# EAGLE design R3Mkr12F_MB_ (EAGLE 9.0.1)
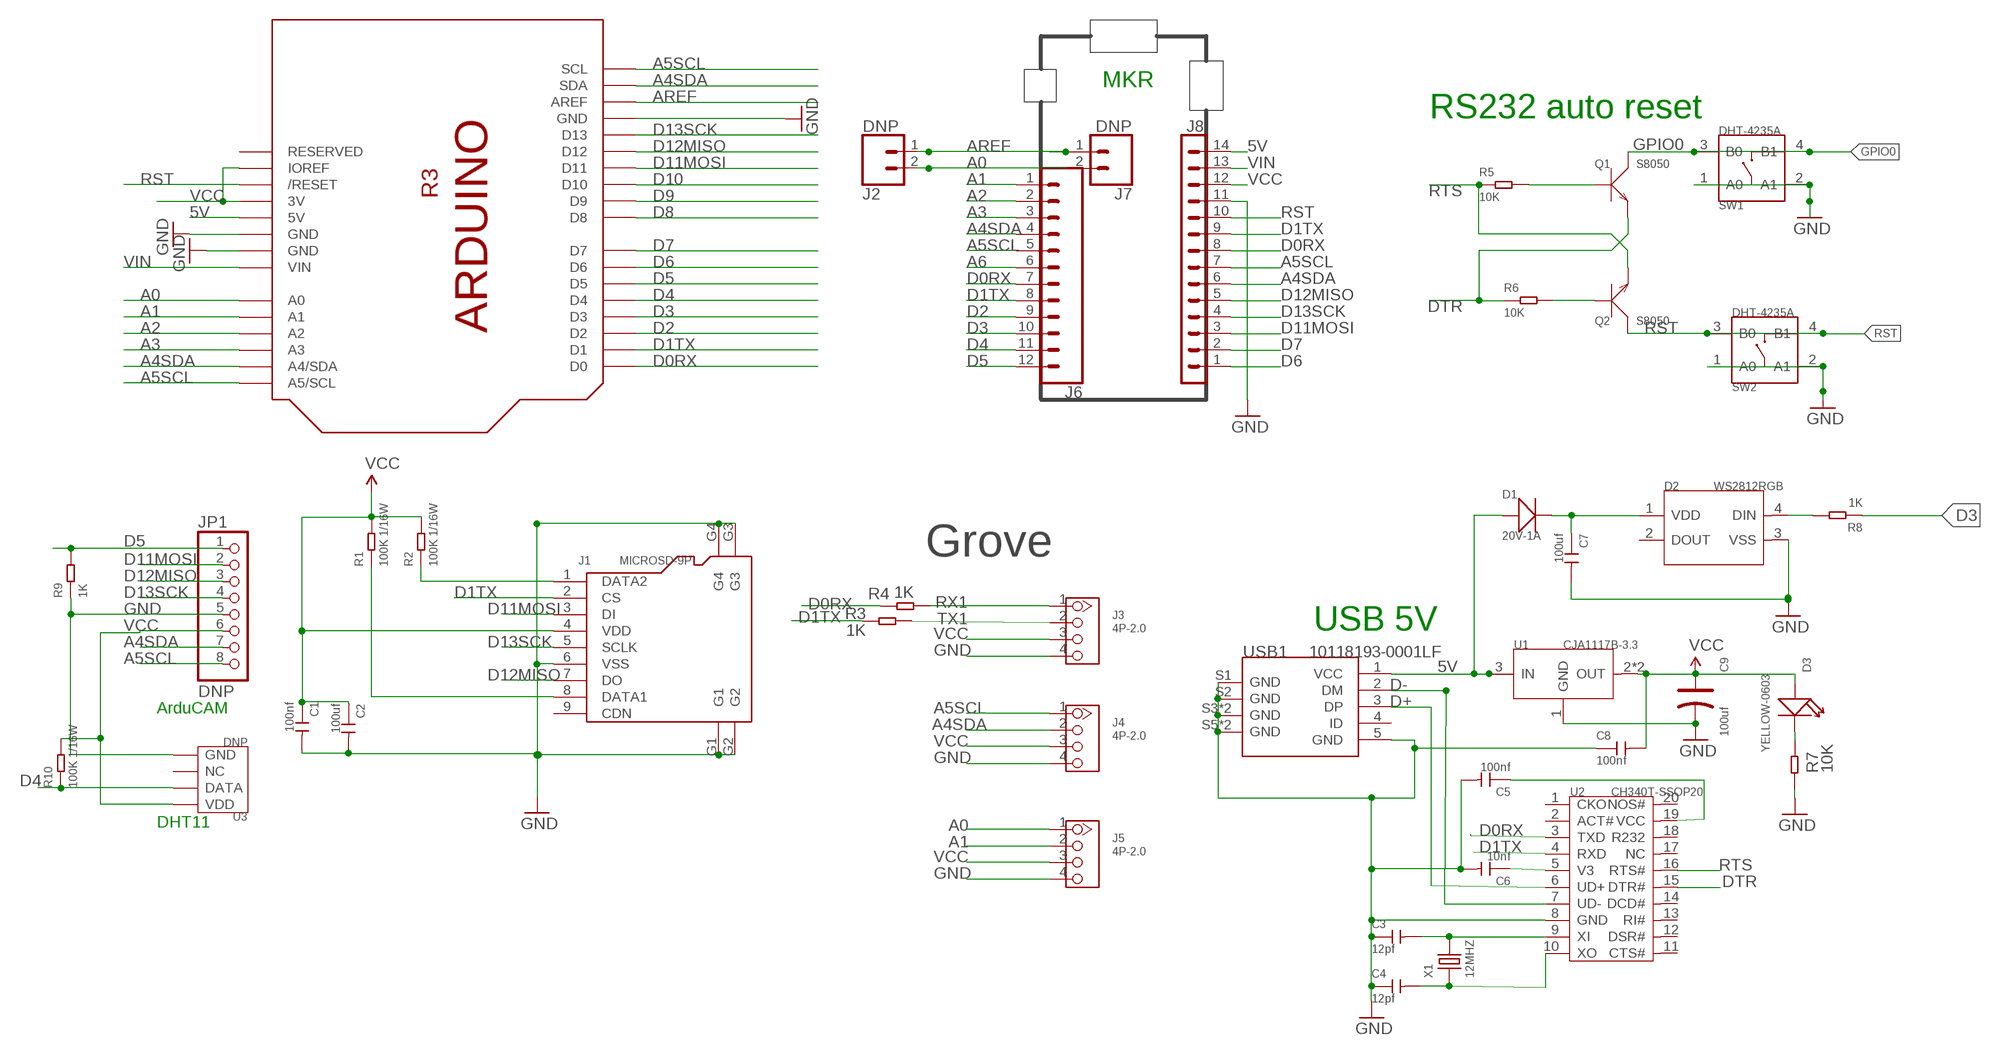
[diagram p0: schematic, sheet 1]

## Parts
C1  100nf  CERAMIC-100NF-50V-10%-X7R(0603)  [C0603]
C2  100uf  CERAMIC-100UF-6.3V-20%-X5R(1206)  [C1206]
C3  12pf  CERAMIC-12PF-50V-5%-NPO(0402)  [C0402]
C4  12pf  CERAMIC-12PF-50V-5%-NPO(0402)  [C0402]
C5  100nf  CERAMIC-100NF-50V-10%-X7R(0603)  [C0603]
C6  10nf  CERAMIC-10NF-50V-10%-X7R(0603)  [C0603]
C7  100uf  CERAMIC-100UF-6.3V-20%-X5R(1206)  [C1206]
C8  100nf  CERAMIC-100NF-50V-10%-X7R(0603)  [C0603]
C9  100uf  TANTALUM-SMD-100UF-10V(AVX-B)  [AVX-B]
D1  20V-1A  SMD-DIODE-SCHOTTKY-20V-1A(SOD-123)  [SOD-123]
D2  WS2812RGB  SMD-RGB-LED-4P'WS2812B'  [LED4-SMD-5050]
D3  YELLOW-0603  SMD-LED-CLEAR-YELLOW(0603)  [LED-0603]
J1  MICROSD-9P  MICRO-SD-CARD-HOLDER-9P  [MICRO-SD9+4P-SMD-16.1X14.5X1.85MM]
J2  DNP  CONN_02  [1X02]
J3  4P-2.0  GROVE-CONNECTOR-DIP(4P-2.0)  [HW4-2.0]
J4  4P-2.0  GROVE-CONNECTOR-DIP(4P-2.0)  [HW4-2.0]
J5  4P-2.0  GROVE-CONNECTOR-DIP(4P-2.0)  [HW4-2.0]
J6  CONN_12LOCK  [1X12_LOCK]
J7  DNP  CONN_02  [1X02]
J8  DNP  STRIP-14STD  [1X14]
JP1  DNP  MILLER_PINHD-1X8LOCK  [MILLER_1X08-LOCK]
Q1  S8050  SMD-TRANSISTORS-NPN-25V-500MW-S8050(SOT-23)  [SOT-23]
Q2  S8050  SMD-TRANSISTORS-NPN-25V-500MW-S8050(SOT-23)  [SOT-23]
R1  100K 1/16W  SMD-RES-100K-5%-1/16W(0402)  [R0402]
R2  100K 1/16W  SMD-RES-100K-5%-1/16W(0402)  [R0402]
R3  1K  SMD-RES-1K-5%-1/8W(0805)  [R0805]
R4  1K  SMD-RES-1K-5%-1/8W(0805)  [R0805]
R5  10K  SMD-RES-10K-5%-1/(0402)  [R0402]
R6  10K  SMD-RES-10K-5%-1/(0402)  [R0402]
R7  10K  SMD-RES-10K-5%-1/(0402)  [R0402]
R8  1K  SMD-RES-1K-5%-1/8W(0805)  [R0805]
R9  1K  SMD-RES-1K-5%-1/8W(0805)  [R0805]
R10  100K 1/16W  SMD-RES-100K-5%-1/16W(0402)  [R0402]
SW1  DHT-4235A  SMD-BUTTON-TOP-DHT-4235A(4P-4.2X3.2MM)  [SW4-SMD-4.2X3.2X2.5MM]
SW2  DHT-4235A  SMD-BUTTON-TOP-DHT-4235A(4P-4.2X3.2MM)  [SW4-SMD-4.2X3.2X2.5MM]
U1  CJA1117B-3.3  PMIC-CJ1117'SOT89'  [SOT-89]
U2  CH340T-SSOP20  INTERFACE-CH340T(SSOP20)  [SSOP20-0.65-7.6X5.2MM]
U3  DNP  TEM-HUM-DHT11(4P-15.5X12.0MM)  [SNR4-2.54-15.5X12.0X5.5MM]
UNO1  ARDUINO_R3_NOICSP_47MM  [ARDUINOR3_NOICSP_47MM]
USB1  10118193-0001LF  MICRO-USB-SMD-B-(10118193-0001LF)  [MICRO-USB5+6P-SMD-0.65-B]
X1  12MHZ  SMD-CRYSTAL-12MHZ-20PF-20PPM-40R(2P-5.0X3.2MM)  [X2-SMD-5.0X3.2X1.3MM]

## Nets
5V [power]: D1.+ J8.14 U1.3(IN) UNO1.5V USB1.1(VCC)
A0: J2.2 J5.1 J7.2 UNO1.A0
A1: J5.2 J6.1 UNO1.A1
A2: J6.2 UNO1.A2
A3: J6.3 UNO1.A3
A4SDA: J4.2 J6.4 J8.6 JP1.7 UNO1.A4(A4/SDA) UNO1.SDA
A5SCL: J4.1 J6.5 J8.7 JP1.8 UNO1.A5(A5/SCL) UNO1.SCL
A6: J6.6
AREF: J2.1 J7.1 UNO1.AREF
D0RX: J6.7 J8.8 R4.2 U2.3(TXD) UNO1.D0
D1TX: J1.2(CS) J6.8 J8.9 R3.2 U2.4(RXD) UNO1.D1
D2: J6.9 UNO1.D2
D3: J6.10 R8.1 UNO1.D3
D4: J6.11 R10.1 U3.2(DATA) UNO1.D4
D5: J6.12 JP1.1 R9.2 UNO1.D5
D6: J8.1 UNO1.D6
D7: J8.2 UNO1.D7
D8: UNO1.D8
D9: UNO1.D9
D10: UNO1.D10
D11MOSI: J1.3(DI) J8.3 JP1.2 UNO1.D11
D12MISO: J1.7(DO) J8.5 JP1.3 UNO1.D12
D13SCK: J1.5(SCLK) J8.4 JP1.4 UNO1.D13
D+: U2.6(UD+) USB1.3(DP)
D-: U2.7(UD-) USB1.2(DM)
DTR: Q1.2(E) R6.1 U2.15(DTR#)
GND [power]: C1.2 C2.2 C3.1 C4.1 C5.2 C6.2 C7.2 C8.1 C9.- D2.3(VSS) J1.6(VSS) J1.G1 J1.G2 J1.G3 J1.G4 J3.4 J4.4 J5.4 J8.11 JP1.5 R7.1 R9.1 SW1.1(A0) SW1.2(A1) SW2.1(A0) SW2.2(A1) U1.1(GND) U2.8(GND) U3.4(GND) UNO1.GND UNO1.GND@1(GND) UNO1.GND@2(GND) USB1.5(GND) USB1.S1(GND) USB1.S2(GND) USB1.S3(GND) USB1.S4(GND) USB1.S5(GND) USB1.S6(GND)
GPIO0: Q1.3(C) SW1.3(B0) SW1.4(B1)
N$2 [power]: C3.2 U2.9(XI) X1.2
N$3 [power]: C4.2 U2.10(XO) X1.1
N$5: J1.8(DATA1) R1.1
N$6: J1.1(DATA2) R2.1
N$8: D2.4(DIN) R8.2
N$10: Q2.1(B) R6.2
N$11: Q1.1(B) R5.2
N$12: D3.- R7.2
RST: J8.10 Q2.3(C) SW2.3(B0) SW2.4(B1) UNO1.RESET(/RESET)
RTS: Q2.2(E) R5.1 U2.16(RTS#)
RX1: J3.1 R4.1
TX1: J3.2 R3.1
V1 [power]: C7.1 D1.- D2.1(VDD)
V3: C6.1 U2.5(V3)
VCC [power]: C1.1 C2.1 C5.1 C8.2 C9.+ D3.+ J1.4(VDD) J3.3 J4.3 J5.3 J8.12 JP1.6 R1.2 R2.2 R10.2 U1.2(OUT) U1.4(OUT) U2.19(VCC) U3.1(VDD) UNO1.3V UNO1.IOREF
VIN [power]: J8.13 UNO1.VIN
Unconnected: D2.2(DOUT) J1.9(CDN) U2.1(CKO) U2.2(ACT#) U2.11(CTS#) U2.12(DSR#) U2.13(RI#) U2.14(DCD#) U2.17(NC) U2.18(R232) U2.20(NOS#) U3.3(NC) UNO1.RESERVED USB1.4(ID)

## Notes on the sheet
- MKR
- RS232 auto reset
- Grove
- USB 5V
- ArduCAM
- DHT11

## Library data of the parts
C1 C5 C8 = Seeed-Capacitor:CERAMIC-100NF-50V-10%-X7R(0603): 302010138; MPN: CC0603KRX7R9BB104
C2 C7 = Seeed-Capacitor:CERAMIC-100UF-6.3V-20%-X5R(1206): 302010183; MPN: GRM31CR60J107ME39L
C3 C4 = Seeed-Capacitor:CERAMIC-12PF-50V-5%-NPO(0402): 302010049; MPN: CC0402JRNPO9BN120
C6 = Seeed-Capacitor:CERAMIC-10NF-50V-10%-X7R(0603): 302010140; MPN: CC0603KRX7R9BB103
C9 = Seeed-Capacitor:TANTALUM-SMD-100UF-10V(AVX-B): 302020015; MPN: TAJB107M010#NJ
D1 = Seeed-Diode:SMD-DIODE-SCHOTTKY-20V-1A(SOD-123): 304020034; MPN: B5819W
D2 = Seeed-Diode:SMD-RGB-LED-4P: 304990003
D3 = Seeed-LED:SMD-LED-CLEAR-YELLOW(0603): 304090044; MPN: 19-217-Y5C-AM1N1VY-3T
J1 = Seeed-Connector:MICRO-SD-CARD-HOLDER-9P: 320090008
J2 J7 = SparkFun-Connectors:CONN_02: Multi connection point. Often used as Generic Header-pin footprint for 0.1 inch spaced/style header connections On any of the 0.1 inch spaced packages, you can populate with these: Break Away Headers - Straight <https://www.sparkfun.com/products/116> (PRT-00116) Break Away Male Headers - Right Angle <https://www.sparkfun.com/products/553> (PRT-00553) Female Headers <https://www.sparkfun.com/products/115> (PRT-00115) Break Away Headers - Machine Pin <https://www.sparkfun.com/products/117> (PRT-00117) Break Away Female Headers - Swiss Machine Pin <https://www.sparkfun.com/products/743> (PRT-00743) For SCREWTERMINALS and SPRING TERMINALS visit here: Screw Terimnals on SparkFun.com <https://www.sparkfun.com/search/results?term=Screw+Terminals> (5mm/3.5mm/2.54mm spacing) This device is also useful as a general connection point to wire up your design to another part of your project. Our various solder wires solder well into these plated through hole pads. Hook-Up Wire - Assortment (Stranded, 22 AWG) <https://www.sparkfun.com/products/11375> (PRT-11375) Hook-Up Wire - Assortment (Solid Core, 22 AWG) <https://www.sparkfun.com/products/11367> (PRT-11367) View the entire wire category on our website here <https://www.sparkfun.com/categories/141> Special notes: Molex polarized connector foot print use with: PRT-08233 with associated crimp pins and housings. 2.54_SCREWTERM for use with PRT-10571. 3.5mm Screw Terminal footprints for PRT-08084 5mm Screw Terminal footprints for use with PRT-08432
J3-J5 = Seeed-Connector:GROVE-CONNECTOR-DIP(4P-2.0): 320110033
J6 = SparkFun-Connectors:CONN_12: Multi connection point. Often used as Generic Header-pin footprint for 0.1 inch spaced/style header connections On any of the 0.1 inch spaced packages, you can populate with these: Break Away Headers - Straight <https://www.sparkfun.com/products/116> (PRT-00116) Break Away Male Headers - Right Angle <https://www.sparkfun.com/products/553> (PRT-00553) Female Headers <https://www.sparkfun.com/products/115> (PRT-00115) Break Away Headers - Machine Pin <https://www.sparkfun.com/products/117> (PRT-00117) Break Away Female Headers - Swiss Machine Pin <https://www.sparkfun.com/products/743> (PRT-00743) For SCREWTERMINALS and SPRING TERMINALS visit here: Screw Terimnals on SparkFun.com <https://www.sparkfun.com/search/results?term=Screw+Terminals> (5mm/3.5mm/2.54mm spacing) This device is also useful as a general connection point to wire up your design to another part of your project. Our various solder wires solder well into these plated through hole pads. Hook-Up Wire - Assortment (Stranded, 22 AWG) <https://www.sparkfun.com/products/11375> (PRT-11375) Hook-Up Wire - Assortment (Solid Core, 22 AWG) <https://www.sparkfun.com/products/11367> (PRT-11367) View the entire wire category on our website here <https://www.sparkfun.com/categories/141> Special notes: Molex polarized connector foot print use with SKU : PRT-08231 with associated crimp pins and housings. 1MM SMD Version SKU: PRT-10208 NOTES ON THE VARIANTS LOCK and LOCK_LONGPADS... This footprint was designed to help hold the alignment of a through-hole component (i.e. 6-pin header) while soldering it into place. You may notice that each hole has been shifted either up or down by 0.005 of an inch from it's more standard position (which is a perfectly straight line). This slight alteration caused the pins (the squares in the middle) to touch the edges of the holes. Because they are alternating, it causes a "brace" to hold the component in place. 0.005 has proven to be the perfect amount of "off-center" position when using our standard breakaway headers. Although looks a little odd when you look at the bare footprint, once you have a header in there, the alteration is very hard to notice. Also,if you push a header all the way into place, it is covered up entirely on the bottom side.
J8 = Arduino-connectors:STRIP-14
JP1 = MKR12FUNO99:MILLER_PINHD-1X8: PIN HEADER
Q1 Q2 = Seeed-Transistor:SMD-TRANSISTORS-NPN-25V-500MW-S8050(SOT-23): 305010017; MPN: S8050
R1 R2 R10 = Seeed-Resistor:SMD-RES-100K-5%-1/16W(0402): 301010033; MPN: RC0402JR-07100KL
R3 R4 R8 R9 = Seeed-Resistor:SMD-RES-1K-5%-1/8W(0805): 301010311; MPN: RC0805JR-071KL
R5-R7 = Seeed-Resistor:SMD-RES-10K-5%-1/(0402): 301010004; MPN: RC0402JR-0710KL
SW1 SW2 = Seeed-Switch:SMD-BUTTON-TOP-DHT-4235A(4P-4.2X3.2MM): 311020045; MPN: DHT-4235A
U1 = IC-new:PMIC-CJ*1117: Low Drop Fixed And Adjustable Positive Voltage Regulators http://www.datasheetcatalog.org/datasheet/SGSThomsonMicroelectronics/mXuqtqv.pdf
U2 = Seeed-IC:INTERFACE-CH340T(SSOP20): 310070026; MPN: CH340T
U3 = Seeed-Sensor:TEM-HUM-DHT11(4P-15.5X12.0MM): 314010000; MPN: DHT11; VALUE: DHT11
UNO1 = MKR12FUNO99:ARDUINO_R3_NOICSP_47MM: Arduino R3 NoICSP 49mm
USB1 = Seeed-Connector:MICRO-USB-SMD-B-(10118193-0001LF): 320010003; MPN: 10118193-0001LF
X1 = Seeed-Crystal Oscillator:SMD-CRYSTAL-12MHZ-20PF-20PPM-40R(2P-5.0X3.2MM): 306010047; MPN: 5032/2P

## Net classes
0 default: width 0.152 mm, drill 0.305 mm, clearance 0.152 mm
1 power: width 0.356 mm, clearance 0.203 mm

## Board
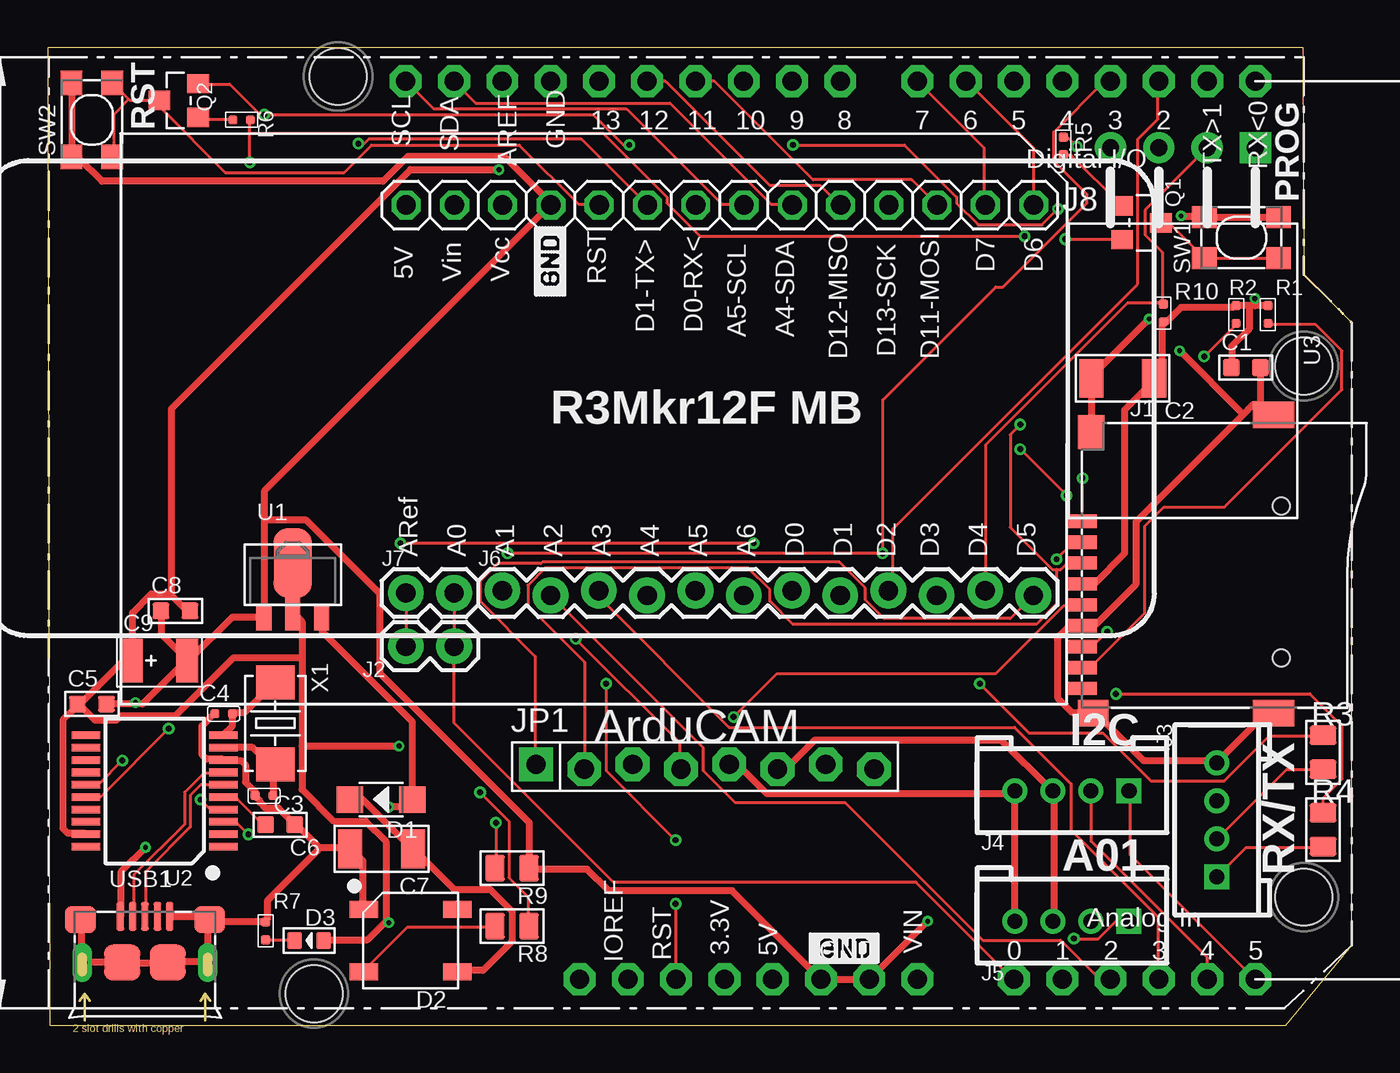
[diagram p1: board, top side]
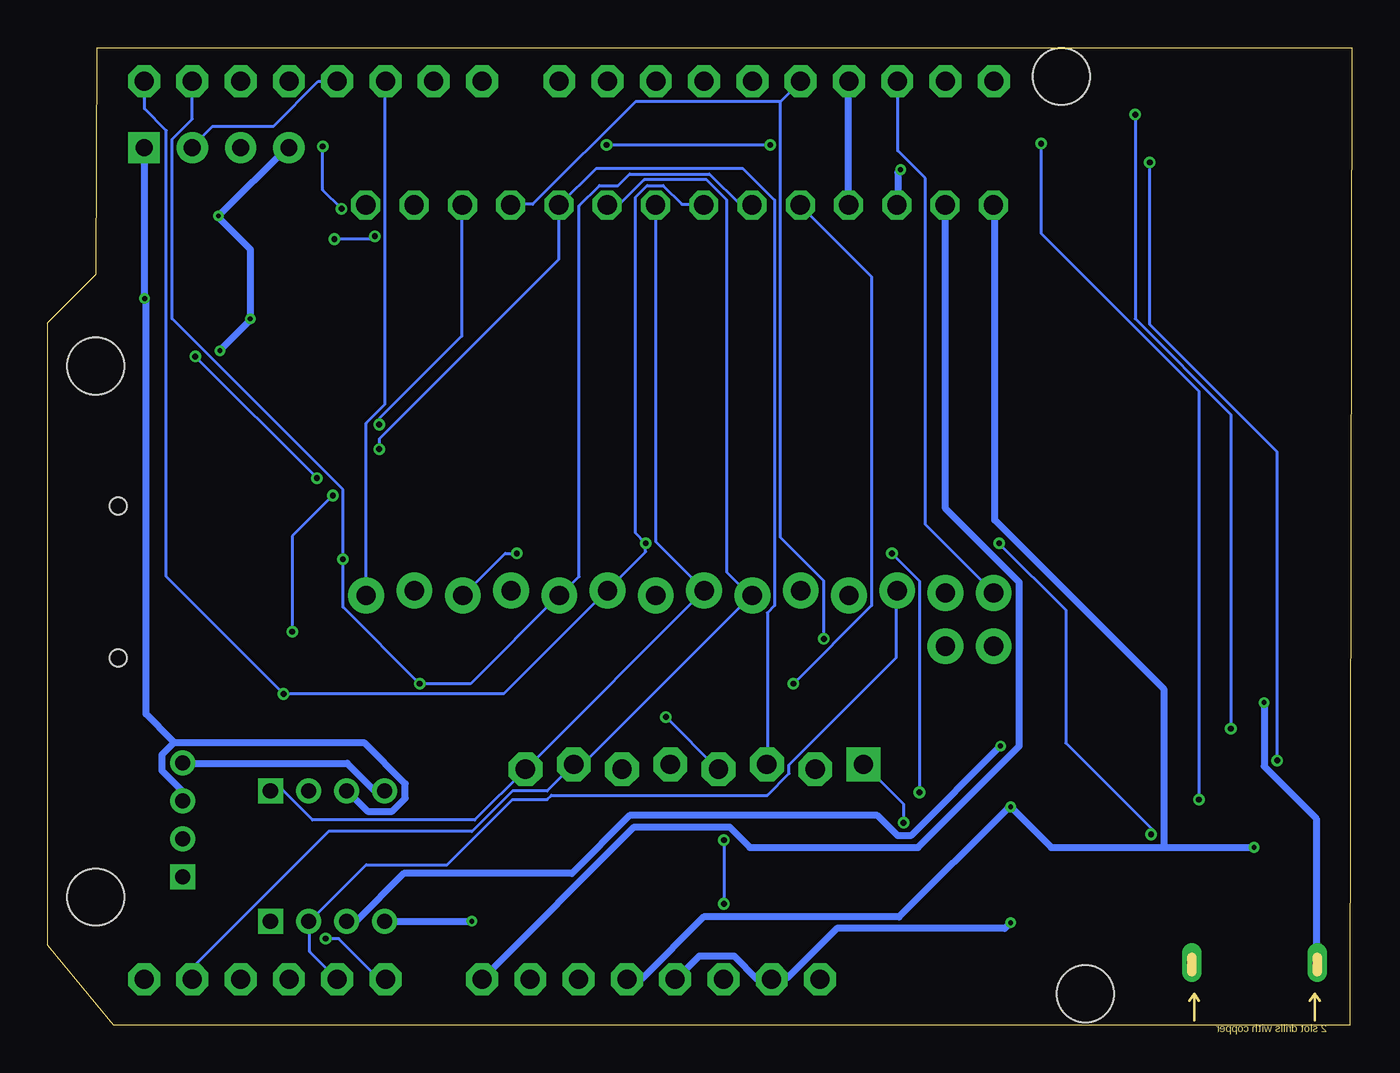
[diagram p2: board, bottom side, seen from below]

Size 68.63 x 51.44 mm. Coordinates in mm from the lower left corner, seen from the top.
Outline: 0.13,0 65.15,0 68.63,4.19 68.63,36.96 66.09,39.5 66.04,51.44 0,51.44 0.13,0
Copper layers (1*16): Top 0.035mm / dielectric 1.5mm / Bottom 0.035mm
Design rules "SeeedStudio_2layers *": minimum track width 6mil, minimum drill 10mil, track to track 6mil, track to pad 6mil, pad to pad 6mil, via to via 6mil, smd to smd 0mil, copper to edge 16mil, drill to drill 10mil, minimum pad ring 10mil, minimum via ring 6mil, stop-mask expansion 2mil, vias tented up to drill 100mil, thermal gap 10mil
tRestrict: area 0.1,23.5 to 3.9,41.3
bRestrict: area 0.1,23.2 to 3.9,41.3

### Footprints (pad centres in the part's own frame; a part is rotated, then mirrored left to right if it is on the bottom)
C0603 = smd 0.889 x 0.889: 1 0,0.762; 2 0,-0.762
C1206 = smd 1.27 x 2.032: 1 -1.651,0; 2 1.651,0
C0402 = smd 0.5 x 0.5: 1 0,0.463; 2 0,-0.463
AVX-B = smd 1.143 x 2.286: + -1.46,0; - 1.46,0
SOD-123 = smd 1.397 x 1.397: + -1.651,0; - 1.651,0
LED4-SMD-5050 = smd 1.5 x 0.9: 1 -2.45,1.65; 2 -2.45,-1.65; 3 2.45,-1.65; 4 2.45,1.65
LED-0603 = smd 0.762 x 0.889: + -0.762,0; - 0.762,0
MICRO-SD9+4P-SMD-16.1X14.5X1.85MM = smd 1.6 x 0.7: 1 0,2.25; 2 0,1.15; 3 0,0.05; 4 0,-1.05; 5 0,-2.15; 6 0,-3.25; 7 0,-4.35; 8 0,-5.45; 9 0,-6.55 | smd 1.6 x 1.4: G1 0.6,-7.85 | smd 2.2 x 1.4: G2 10.1,-7.85; G3 10.1,7.85 | smd 1.4 x 1.8: G4 0.5,6.95 | hole 0.9: 10.5,-4.95; 10.5,3.05
1X02 = drill 1.016 pad 1.88: 1 0,0; 2 2.54,0
HW4-2.0 = drill 0.8 pad 1.27 square: 1 -3,0 | drill 0.8 pad 1.27: 2 -1,0; 3 1,0; 4 3,0
1X12_LOCK = drill 1.016 pad 1.88: 1 0,0.127; 2 2.54,-0.127; 3 5.08,0.127; 4 7.62,-0.127; 5 10.16,0.127; 6 12.7,-0.127; 7 15.24,0.127; 8 17.78,-0.127; 9 20.32,0.127; 10 22.86,-0.127; 11 25.4,0.127; 12 27.94,-0.127
1X14 = drill 1.016 octagon: 1 -16.51,0; 2 -13.97,0; 3 -11.43,0; 4 -8.89,0; 5 -6.35,0; 6 -3.81,0; 7 -1.27,0; 8 1.27,0; 9 3.81,0; 10 6.35,0; 11 8.89,0; 12 11.43,0; 13 13.97,0; 14 16.51,0
MILLER_1X08-LOCK = drill 1.016 pad 1.778 square: 1 -8.89,0.127 | drill 1.016 pad 1.778 octagon: 2 -6.35,-0.127; 3 -3.81,0.127; 4 -1.27,-0.127; 5 1.27,0.127; 6 3.81,-0.127; 7 6.35,0.127; 8 8.89,-0.127
SOT-23 = smd 1.016 x 1.143: 1 -0.889,-1.016; 2 0.889,-1.016; 3 0,1.016
R0402 = smd 0.5 x 0.5: 1 0,0.463; 2 0,-0.463
R0805 = smd 1.397 x 1.016: 1 0,0.889; 2 0,-0.889
SW4-SMD-4.2X3.2X2.5MM = smd 1.3 x 1.15: 1 -1.95,1.075; 2 1.95,1.075; 3 -1.95,-1.075; 4 1.95,-1.075
SOT-89 = smd 0.8 x 1.4: 1 -1.524,-1.905; 3 1.524,-1.905 | smd 0.8 x 1.9: 2 0,-1.651 | smd 2.032 x 3.65: 4 0,0.94
SSOP20-0.65-7.6X5.2MM = smd 0.4 x 1.5: 1 -2.925,-3.625; 2 -2.275,-3.625; 3 -1.625,-3.625; 4 -0.975,-3.625; 5 -0.325,-3.625; 6 0.325,-3.625; 7 0.975,-3.625; 8 1.625,-3.625; 9 2.275,-3.625; 10 2.925,-3.625; 11 2.925,3.625; 12 2.275,3.625; 13 1.625,3.625; 14 0.975,3.625; 15 0.325,3.625; 16 -0.325,3.625; 17 -0.975,3.625; 18 -1.625,3.625; 19 -2.275,3.625; 20 -2.925,3.625
SNR4-2.54-15.5X12.0X5.5MM = drill 0.889 pad 1.651 square: 1 -11.75,3.81 | drill 0.889 pad 1.651: 2 -11.75,1.27; 3 -11.75,-1.27; 4 -11.75,-3.81
ARDUINOR3_NOICSP_47MM = drill 1 pad 1.676 octagon: 3V 35.56,3.302; 5V 38.1,3.302; A0 50.8,3.302; A1 53.34,3.302; A2 55.88,3.302; A3 58.42,3.302; A4 60.96,3.302; A5 63.5,3.302; AREF 23.876,50.546; D0 63.5,50.546; D1 60.96,50.546; D2 58.42,50.546; D3 55.88,50.546; D4 53.34,50.546; D5 50.8,50.546; D6 48.26,50.546; D7 45.72,50.546; D8 41.656,50.546; D9 39.116,50.546; D10 36.576,50.546; D11 34.036,50.546; D12 31.496,50.546; D13 28.956,50.546; GND 26.416,50.546; GND@1 43.18,3.302; GND@2 40.64,3.302; IOREF 30.48,3.302; RESERVED 27.94,3.302; RESET 33.02,3.302; SCL 18.796,50.546; SDA 21.336,50.546; VIN 45.72,3.302 | hole 3: 15.24,50.8; 13.97,2.54; 66.04,7.62; 66.04,35.56
MICRO-USB5+6P-SMD-0.65-B = smd 0.4 x 1.5: 1 -1.3,-0.25; 2 -0.65,-0.25; 3 0,-0.25; 4 0.65,-0.25; 5 1.3,-0.25 | smd 1.6 x 1.4: S1 -3.4,-0.427; S6 3.4,-0.427 | drill 0.508 pad 1.016 long: S2 -3.3,-2.675; S5 3.3,-2.675 | smd 1.9 x 1.9: S3 -1.2,-2.675; S4 1.2,-2.675
X2-SMD-5.0X3.2X1.3MM = smd 1.778 x 2.032: 1 -2.159,0; 2 2.159,0

### Placement (x,y rotation side)
C1  63.04,34.59 90 top
C2  56.57,34.04 180 top
C3  11.39,12.06 90 top
C4  9.27,16.38 90 top
C5  2.34,16.89 90 top
C6  12.24,10.54 90 top
C7  17.58,9.27 180 top
C8  6.73,21.79 90 top
C9  5.89,19.18 0 top
D1  17.55,11.86 180 top
D2  19.1,4.45 180 top
D3  13.77,4.45 180 top
J1  54.41,24.26 0 top
J2  18.85,19.94 0 top
J3  61.52,10.79 90 top
J4  53.9,12.32 180 top
J5  53.9,5.46 180 top
J6  23.93,22.73 0 top
J7  18.85,22.73 0 top
J8  35.38,43.15 180 top
JP1  34.59,13.59 0 top
Q1  57.56,42.21 270 top
Q2  6.91,48.64 90 top
R1  64.21,37.39 180 top
R2  62.53,37.39 180 top
R3  67.11,14.35 180 top
R4  67.11,10.29 180 top
R5  53.44,46.25 0 top
R6  10.21,47.62 270 top
R7  11.48,4.95 0 top
R8  24.43,5.21 270 top
R9  24.43,8.25 270 top
R10  58.7,37.47 0 top
SW1  62.81,41.43 0 top
SW2  2.34,47.62 90 top
U1  12.9,23.37 0 top
U2  5.64,12.32 90 top
U3  59.74,34.42 270 top
UNO1  0.05,-0.89 0 top
USB1  5.13,5.97 0 top
X1  11.99,15.88 270 top

### Tracks (layer width: path | path; a pad name or v marks a point on that pad's centre or on a via)
5V  (via drill 0.25)
  Top 0.356: U1.3 14.45,21.46 14.45,20.7 19.18,15.98 19.18,11.86 D1.+ 19.02,11.79 18.72,11.48 v17.96,11.48 | v5.16,9.35 3.86,8.05 3.86,5.77 USB1.1
  Bottom 0.356: 9.88,9.35 15.82,9.35 v17.96,11.48 18.11,11.4 23.82,5.69 34.11,5.69 37.39,2.41 UNO1.5V | 9.88,9.35 v5.16,9.35 | 9.88,9.35 9.88,17.65 18.8,26.57 18.8,43.1 J8.14
A0  (via drill 0.3)
  Top 0.152: J7.2 J2.2 21.39,15.9 29.77,7.52 45.69,7.52 50.8,2.41 UNO1.A0 | J5.1 56.21,5.46 55.3,4.55 v54,4.55
  Bottom 0.152: v54,4.55 53.31,4.55 51.18,2.41 UNO1.A0
A1
  Bottom 0.152: 54.84,5.46 54.84,3.86 UNO1.A1 | 54.84,5.46 51.87,8.43 47.6,8.43 44.17,11.86 42.34,11.86 42.11,12.09 30.76,12.09 29.62,13.23 29.62,13.69 23.98,19.33 23.98,22.84 J6.1 | 54.84,5.46 J5.2
A2
  Top 0.152: UNO1.A2 55.37,2.41 53.31,4.47 49.2,4.47 41.96,11.71 36.17,11.71 34.49,13.39 34.49,14.6 26.49,22.61 J6.2
A3
  Top 0.152: J6.3 29.01,22.53 35.86,15.67 50.88,15.67 53.85,12.7 53.85,10.26 58.42,5.69 58.42,2.41 UNO1.A3
A4SDA
  Top 0.152: UNO1.SDA 22.53,48.51 32.74,48.51 38.07,43.18 39.14,43.18 J8.6 | UNO1.A4 61.01,3.56 54.91,9.65 54.91,12.32 J4.2
  Bottom 0.152: UNO1.A4 61.01,3.02 53.85,10.18 46.3,10.18 44.17,12.32 42.34,12.32 JP1.7 40.89,13.77 40.44,13.77 31.6,22.61 J6.4 31.67,22.61 32.89,23.82 32.89,43.41 33.96,44.48 37.24,44.48 38.53,43.18 39.14,43.18 J8.6
A5SCL
  Top 0.152: J8.7 36.63,43.18 35.48,43.18 30.45,48.21 20.32,48.21 18.87,49.66 UNO1.SCL | J4.1 56.97,12.32 56.97,8.97 63.53,2.41 UNO1.A5
  Bottom 0.152: J4.1 56.21,12.32 54.69,10.79 46.15,10.79 JP1.8 J6.5 34.11,22.91 36.63,25.43 36.63,43.1 J8.7
AREF
  Top 0.152: J2.1 18.87,19.94 18.87,22.68 J7.1
  Bottom 0.152: J7.1 22.45,26.34 22.45,44.55 23.9,46 23.9,49.66 UNO1.AREF
D0RX  (via drill 0.3)
  Top 0.152: R4.2 67.11,11.94 68.1,12.93 68.1,15.75 66.42,17.42 v56.21,17.42 | v10.57,10.03 9.96,10.64 9.27,10.64 U2.3 | v37.16,25.35 v18.57,25.35
  Bottom 0.152: v10.57,10.03 10.57,10.34 15.06,14.83 15.06,21.84 v18.57,25.35 | J8.8 34.11,43.18 35.25,43.18 36.25,44.17 37.08,44.17 37.69,43.56 37.69,25.88 v37.16,25.35 37.16,24.89 39.14,22.91 J6.7 39.22,22.84 44.63,17.42 v56.21,17.42 62.38,23.6 62.38,47.07 63.53,48.21 63.53,49.66 UNO1.D0
D1TX  (via drill 0.3)
  Top 0.152: v8.05,11.86 8.51,11.4 9.19,11.4 U2.4 | v16.36,46.38 16.66,46.38 16.89,46.61 28.09,46.61 31.52,43.18 J8.9 | v49.05,17.96 51.64,15.37 55.52,15.37 58.04,12.85 61.92,12.85 64.29,15.21 67.11,15.21 R3.2 | v53.09,24.51 53.92,25.35 54.38,25.35 J1.2
  Bottom 0.152: v8.05,11.86 8.05,33.35 16.36,41.66 v16.36,46.38 | UNO1.D1 61.01,47.68 62.08,46.61 62.08,37.16 53.09,28.17 v53.09,24.51 53.09,22 v49.05,17.96 46.38,17.96 41.73,22.61 J6.8 41.66,22.61 40.67,23.6 40.67,43.1 39.6,44.17 38.61,44.17 38,44.78 33.81,44.78 32.21,43.18 31.6,43.18 J8.9
D2
  Top 0.152: UNO1.D2 58.42,49.66 58.42,47.68 57.35,46.61 57.35,38.99 44.48,26.11 44.48,23.14 44.25,22.91 J6.9
D3  (via drill 0.3)
  Top 0.152: v22.76,12.24 24.28,10.72 24.28,7.75 25.27,6.76 25.27,5.23 R8.1 | v24.21,24.82 v43.94,24.82 43.94,32.89 49.89,38.84 50.27,38.84 54.69,43.26 54.69,43.71 52.93,45.47 52.93,46.99 55.6,49.66 UNO1.D3
  Bottom 0.152: v22.76,12.24 22.76,23.37 v24.21,24.82 | v43.94,24.82 44.55,24.82 46.76,22.61 J6.10
D4
  Top 0.152: U3.2 61.01,46.15 57.73,42.88 57.73,41.58 58.65,40.67 58.65,38 R10.1 58.57,38 56.82,38 49.35,30.53 49.35,22.91 J6.11
  Bottom 0.152: UNO1.D4 54.38,49.66 56.74,47.3 59.94,47.3 61.01,46.23 U3.2
D5  (via drill 0.3)
  Top 0.152: v23.6,10.64 23.6,8.28 R9.2 | J6.12 50.65,21.39 44.02,21.39 43.03,22.38 43.03,22.99 41.66,24.36 26.03,24.36 25.96,24.28 23.67,24.28 22.76,23.37 22.76,22.3 25.65,19.41 25.65,13.77 JP1.1
  Bottom 0.152: v23.6,10.64 23.6,11.63 25.65,13.69 JP1.1 | J6.12 51.87,31.67 50.88,32.66 50.88,49.66 UNO1.D5
D6
  Top 0.152: J8.1 51.87,43.18 51.87,46.15 48.36,49.66 UNO1.D6
D7
  Top 0.152: UNO1.D7 49.28,46.15 49.28,43.18 J8.2
D11MOSI  (via drill 0.3)
  Top 0.152: 53.09,23.98 52.86,23.98 50.65,26.19 50.65,31.06 v51.18,31.6 | 53.09,23.98 53.31,23.98 53.62,24.28 54.38,24.28 J1.3 | UNO1.D11 35.1,49.66 40.28,44.48 45.47,44.48 46.76,43.18 J8.3 | JP1.2 28.24,19.1 25.27,22.07 25.27,23.14 26.19,24.05 36.86,24.05 38,22.91 38,22.3 39.22,21.08 52.02,21.08 53.09,22.15 53.09,23.98
  Bottom 0.152: v51.18,31.6 51.18,31.9 46.84,36.25 46.84,43.1 J8.3
D12MISO  (via drill 0.3)
  Top 0.152: v55.75,20.7 54.99,19.94 54.46,19.94 J1.7 | v51.18,30.3 v53.62,27.86 | UNO1.D12 32.51,49.66 38,44.17 40.67,44.17 41.66,43.18 J8.5
  Bottom 0.152: v55.75,20.7 55.75,25.73 v53.62,27.86 | v51.18,30.3 51.18,30.84 41.73,40.28 41.73,43.1 J8.5 41.66,43.18 39.75,45.09 32.05,45.09 30.38,43.41 30.38,22.07 30.76,21.69 30.76,13.77 JP1.3
D13SCK  (via drill 0.3)
  Top 0.152: v36.09,16.21 38.38,18.49 49.89,18.49 53.47,22.07 54.38,22.07 J1.5 | v27.79,20.32 33.27,14.83 33.27,13.46 JP1.4
  Bottom 0.152: 30.07,48.59 37.69,48.59 43.1,43.18 44.25,43.18 J8.4 | UNO1.D13 30.07,48.59 | v36.09,16.21 33.35,13.46 JP1.4 | 30.07,48.59 30.07,25.65 27.79,23.37 v27.79,20.32
D+
  Top 0.152: USB1.3 5.16,5.77 5.16,8.05 7.52,10.41 7.52,12.09 8.05,12.62 9.19,12.62 U2.6
D-
  Top 0.152: USB1.2 4.55,5.77 4.55,7.9 7.21,10.57 7.21,12.24 8.2,13.23 9.19,13.23 U2.7
DTR  (via drill 0.3)
  Top 0.152: v10.64,45.39 10.64,46.91 | 10.64,46.91 10.64,47.6 R6.1 | v3.94,13.92 2.72,12.7 2.03,12.7 U2.15 | v53.54,41.35 56.51,41.35 Q1.2 | v51.41,41.5 34.34,41.5 32.59,43.26 32.59,43.56 29.24,46.91 10.64,46.91
  Bottom 0.152: v10.64,45.39 10.64,36.86 3.94,30.15 v3.94,13.92 | v53.54,41.35 51.56,41.35 v51.41,41.5
GND  (via drill 0.25)
  Top 0.356: USB1.S1 1.8,5.54 1.8,3.33 USB1.S2 1.96,3.33 3.86,3.33 USB1.S3 4.09,3.25 6.15,3.25 USB1.S4 6.38,3.33 8.36,3.33 USB1.S5 8.43,3.48 8.43,5.39 USB1.S6 | USB1.S6 8.58,5.54 8.66,5.46 11.48,5.46 R7.1 11.56,5.61 11.56,6.53 14.22,9.19 14.3,9.35 | USB1.5 6.45,5.69 8.43,5.69 USB1.S6 | D2.3 16.59,6.15 16.59,8.66 15.98,9.27 C7.2 15.82,9.35 14.3,9.35 | C4.1 8.74,16.36 8.13,15.75 8.13,14.22 8.36,13.99 9.19,13.99 U2.8 9.42,13.92 10.19,13.92 10.41,13.69 10.41,12.78 10.95,12.24 C3.1 10.95,12.01 11.18,11.79 11.18,11.71 11.48,11.4 12.17,11.4 13,10.57 C6.2 13.16,10.49 14.3,9.35 | 4.62,16.89 5,16.89 7.29,19.18 C9.- | 4.62,16.89 C5.2 | C8.1 5.99,21.77 5.99,20.55 7.21,19.33 C9.- | C9.- 7.52,19.25 9.73,21.46 U1.1 11.4,21.61 11.4,26.57 | SW2.2 1.27,49.51 1.27,45.7 SW2.1 1.42,45.62 1.65,45.62 2.87,44.4 17.65,44.4 18.95,45.7 24.05,45.7 26.42,43.33 26.42,43.18 J8.11 26.34,43.03 11.4,28.09 11.4,26.57 | v4.62,16.97 4.62,16.89 | J5.4 50.88,5.46 50.88,12.32 J4.4 50.72,12.17 37.85,12.17 36.32,13.69 35.86,13.69 JP1.5 | v46.3,5.46 43.33,2.49 UNO1.GND@1 UNO1.GND@2 40.67,2.41 36.02,7.06 29.54,7.06 28.4,8.2 25.35,8.2 R9.1 25.35,8.43 25.35,10.64 17.5,18.49 17.5,22.68 13.61,26.57 11.4,26.57 | J1.G4 C2.2 54.99,34.19 v57.96,37.16 | SW1.2 64.74,42.49 60.93,42.49 SW1.1 60.71,42.57 v59.64,42.57 | J1.G2 64.44,16.36 64.06,16.36 61.54,13.84 J3.4 61.39,13.92 57.66,13.92 55.14,16.43 J1.G1 54.99,16.43 53.92,16.43 53.16,17.2 53.16,20.4 53.77,21.01 54.38,21.01 J1.6 54.53,21.08 55.14,21.08 57.28,23.22 57.28,26.49 62.92,32.13 | C1.2 63.83,34.57 63.83,32.74 64.44,32.13 J1.G3 63.68,32.66 63.45,32.66 62.92,32.13
  Top 0.356: 62.92,32.13 v59.56,35.48
  Bottom 0.356: UNO1.GND 26.49,49.66 26.49,43.18 J8.11 | v4.62,16.97 4.62,13.61 1.88,10.87 1.88,3.33 USB1.S2 | J5.4 v46.3,5.46 | U3.4 55.98,46.23 v59.64,42.57 59.56,42.42 57.96,40.82 v57.96,37.16 58.04,37.01 v59.56,35.48 | J4.4 51.41,12.32 52.86,13.77 61.47,13.77 J3.4
GPIO0
  Top 0.152: Q1.3 58.57,42.19 59.03,42.19 60.86,40.36 SW1.3 60.93,40.36 64.74,40.36 SW1.4
N$2
  Top 0.356: C3.2 11.86,12.09 11.86,13.61 11.94,13.69 X1.2 11.71,13.69 10.79,14.6 U2.9
N$3
  Top 0.356: U2.10 9.27,15.29 9.73,15.75 9.73,16.36 C4.2 9.88,16.43 10.34,16.43 11.94,18.03 X1.1
N$5
  Top 0.152: R1.1 64.21,36.86 66.73,36.86 68.1,35.48 68.1,33.43 61.92,27.25 58.72,27.25 57.73,26.26 57.73,21.69 54.91,18.87 54.46,18.87 J1.8
N$6  (via drill 0.3)
  Top 0.152: v60.86,35.18 62.53,36.86 R2.1 | v54.46,28.78 54.46,26.57 J1.1
  Bottom 0.152: v54.46,28.78 v60.86,35.18
N$8
  Top 0.152: R8.2 23.52,5.16 18.95,5.16 16.66,2.87 D2.4
N$10
  Top 0.152: R6.2 9.73,47.68 8.05,47.68 7.98,47.75 Q2.1
N$11
  Top 0.152: R5.2 53.47,45.77 53.85,45.77 56.51,43.1 Q1.1
N$12
  Top 0.152: R7.2 11.48,4.47 13,4.47 D3.-
RST  (via drill 0.3)
  Top 0.152: 4.28,48.71 3.48,49.51 SW2.4 | 4.28,48.71 4.32,48.67 5.84,48.67 Q2.3 5.92,48.59 5.92,48.29 9.35,44.86 15.6,44.86 17.04,46.3 24.82,46.3 27.94,43.18 29.01,43.18 J8.10 | 4.28,48.71 3.48,47.9 3.48,45.7 SW2.3 | v33.05,6.38 33.05,2.41 UNO1.RESET | v33.05,9.73 29.39,13.39 v29.39,17.96
  Bottom 0.152: v33.05,9.73 v33.05,6.38 | v29.39,17.96 25.27,22.07 25.27,39.37 29.01,43.1 J8.10
RTS  (via drill 0.3)
  Top 0.152: v54.15,46.23 53.7,46.69 53.47,46.69 R5.1 | v53.16,42.95 52.32,42.11 48.97,42.11 47.83,43.26 47.83,43.56 45.08,46.3 v39.22,46.3 | v30.61,46.3 30.3,46.3 28.7,47.9 v11.4,47.9 11.18,47.9 9.58,49.51 7.98,49.51 Q2.2 | v6.38,15.6 2.79,12.01 2.03,12.01 U2.16
  Bottom 0.152: v54.15,46.23 54.15,43.94 v53.16,42.95 | v30.61,46.3 v39.22,46.3 | v6.38,15.6 6.38,32.13 11.4,37.16 v11.4,47.9
RX1
  Top 0.152: R4.1 67.11,9.35 63.07,9.35 61.54,7.82 J3.1
TX1
  Top 0.152: R3.1 65.2,13.46 61.54,9.8 J3.2
V1
  Top 0.356: D1.- 16.59,11.86 19.18,9.27 C7.1 19.33,9.19 21.39,7.14 23.29,7.14 24.43,5.99 24.43,4.39 22.91,2.87 21.62,2.87 D2.1
V3
  Top 0.152: C6.1 11.48,10.57 11.33,10.57 9.96,11.94 9.27,11.94 U2.5
VCC  (via drill 0.25)
  Top 0.356: 63.53,37.85 R1.2 | 63.53,37.85 63.22,37.85 | 63.22,37.85 R2.2 62.38,37.77 59.64,37.77 58.88,37.01 R10.2 58.65,36.93 58.65,34.42 58.27,34.04 C2.1 58.19,33.88 56.67,32.36 56.67,24.82 55.07,23.22 54.46,23.22 J1.4 | 63.22,37.85 63.22,36.63 62.31,35.71 62.31,34.65 C1.1 | 63.53,37.85 v63.53,38.23 | J5.3 52.93,5.46 52.93,12.32 J4.3 52.78,12.39 50.19,14.99 40.36,14.99 38.84,13.46 JP1.6 | 17.81,5.46 16.81,4.47 14.53,4.47 D3.+ | 17.81,5.46 17.81,9.65 16.74,10.72 15.06,10.72 13.39,12.39 13.39,14.68 | 13.39,19.33 13.39,21.23 U1.2 12.93,21.84 12.93,24.28 U1.4 | 13.39,19.33 13.39,14.68 | v17.96,5.39 17.81,5.46 | C5.1 1.73,16.89 4.01,19.18 C9.+ 4.47,19.33 4.47,21.69 5.46,22.68 6.45,22.68 | 6.45,22.68 7.29,21.84 7.44,21.84 C8.2 | U2.19 1.96,10.11 1.04,10.11 0.81,10.34 0.81,16.05 1.5,16.74 C5.1 | v23.75,45.01 19.1,45.01 6.53,32.44 6.53,22.84 6.45,22.68 | 13.39,19.33 9.8,19.33 6.76,16.28 3.86,16.28 3.63,16.05 2.49,16.05 1.8,16.74 C5.1 | 13.39,14.68 v18.49,14.68
  Bottom 0.356: U3.1 63.53,46.15 v63.53,38.23 63.45,38.08 63.45,16.36 62.08,14.99 62,14.83 | 62,14.83 62.61,14.22 62.61,13.39 61.54,12.32 61.54,11.86 J3.3 | 62,14.83 51.94,14.83 49.81,12.7 49.81,11.94 50.49,11.25 51.79,11.25 52.86,12.32 J4.3 | UNO1.3V 35.56,2.41 34.34,3.63 32.51,3.63 31.29,2.41 UNO1.IOREF 30.38,2.49 29.69,2.49 27.1,5.08 18.26,5.08 v17.96,5.39 | v23.75,45.01 23.9,44.86 23.9,43.18 J8.12 | J5.3 52.4,5.46 49.89,7.98 41.05,7.98 38,11.02 24.97,11.02 23.9,9.96 23.22,9.96 v18.49,14.68
VIN
  Bottom 0.356: UNO1.VIN 37.77,10.41 32.74,10.41 31.67,9.35 22.83,9.35 17.5,14.68 17.5,23.29 21.39,27.18 21.39,43.1 J8.13

### Text on the board
tPlace: RST | PROG | D7 | D6 | 5V | Vin | Vcc | RST | D1-TX> | D0-RX< | A5-SCL | A4-SDA | D12-MISO | D13-SCK | D11-MOSI | R3Mkr12F MB | ARef | A0 | A1 | A2 | A3 | A4 | A5 | A6 | D0 | D1 | D2 | D3 | D4 | D5 | I2C | ArduCAM | A01 | RX/TX